# Altium schematic sheet 电动手推车原理图.SchDoc
size A3
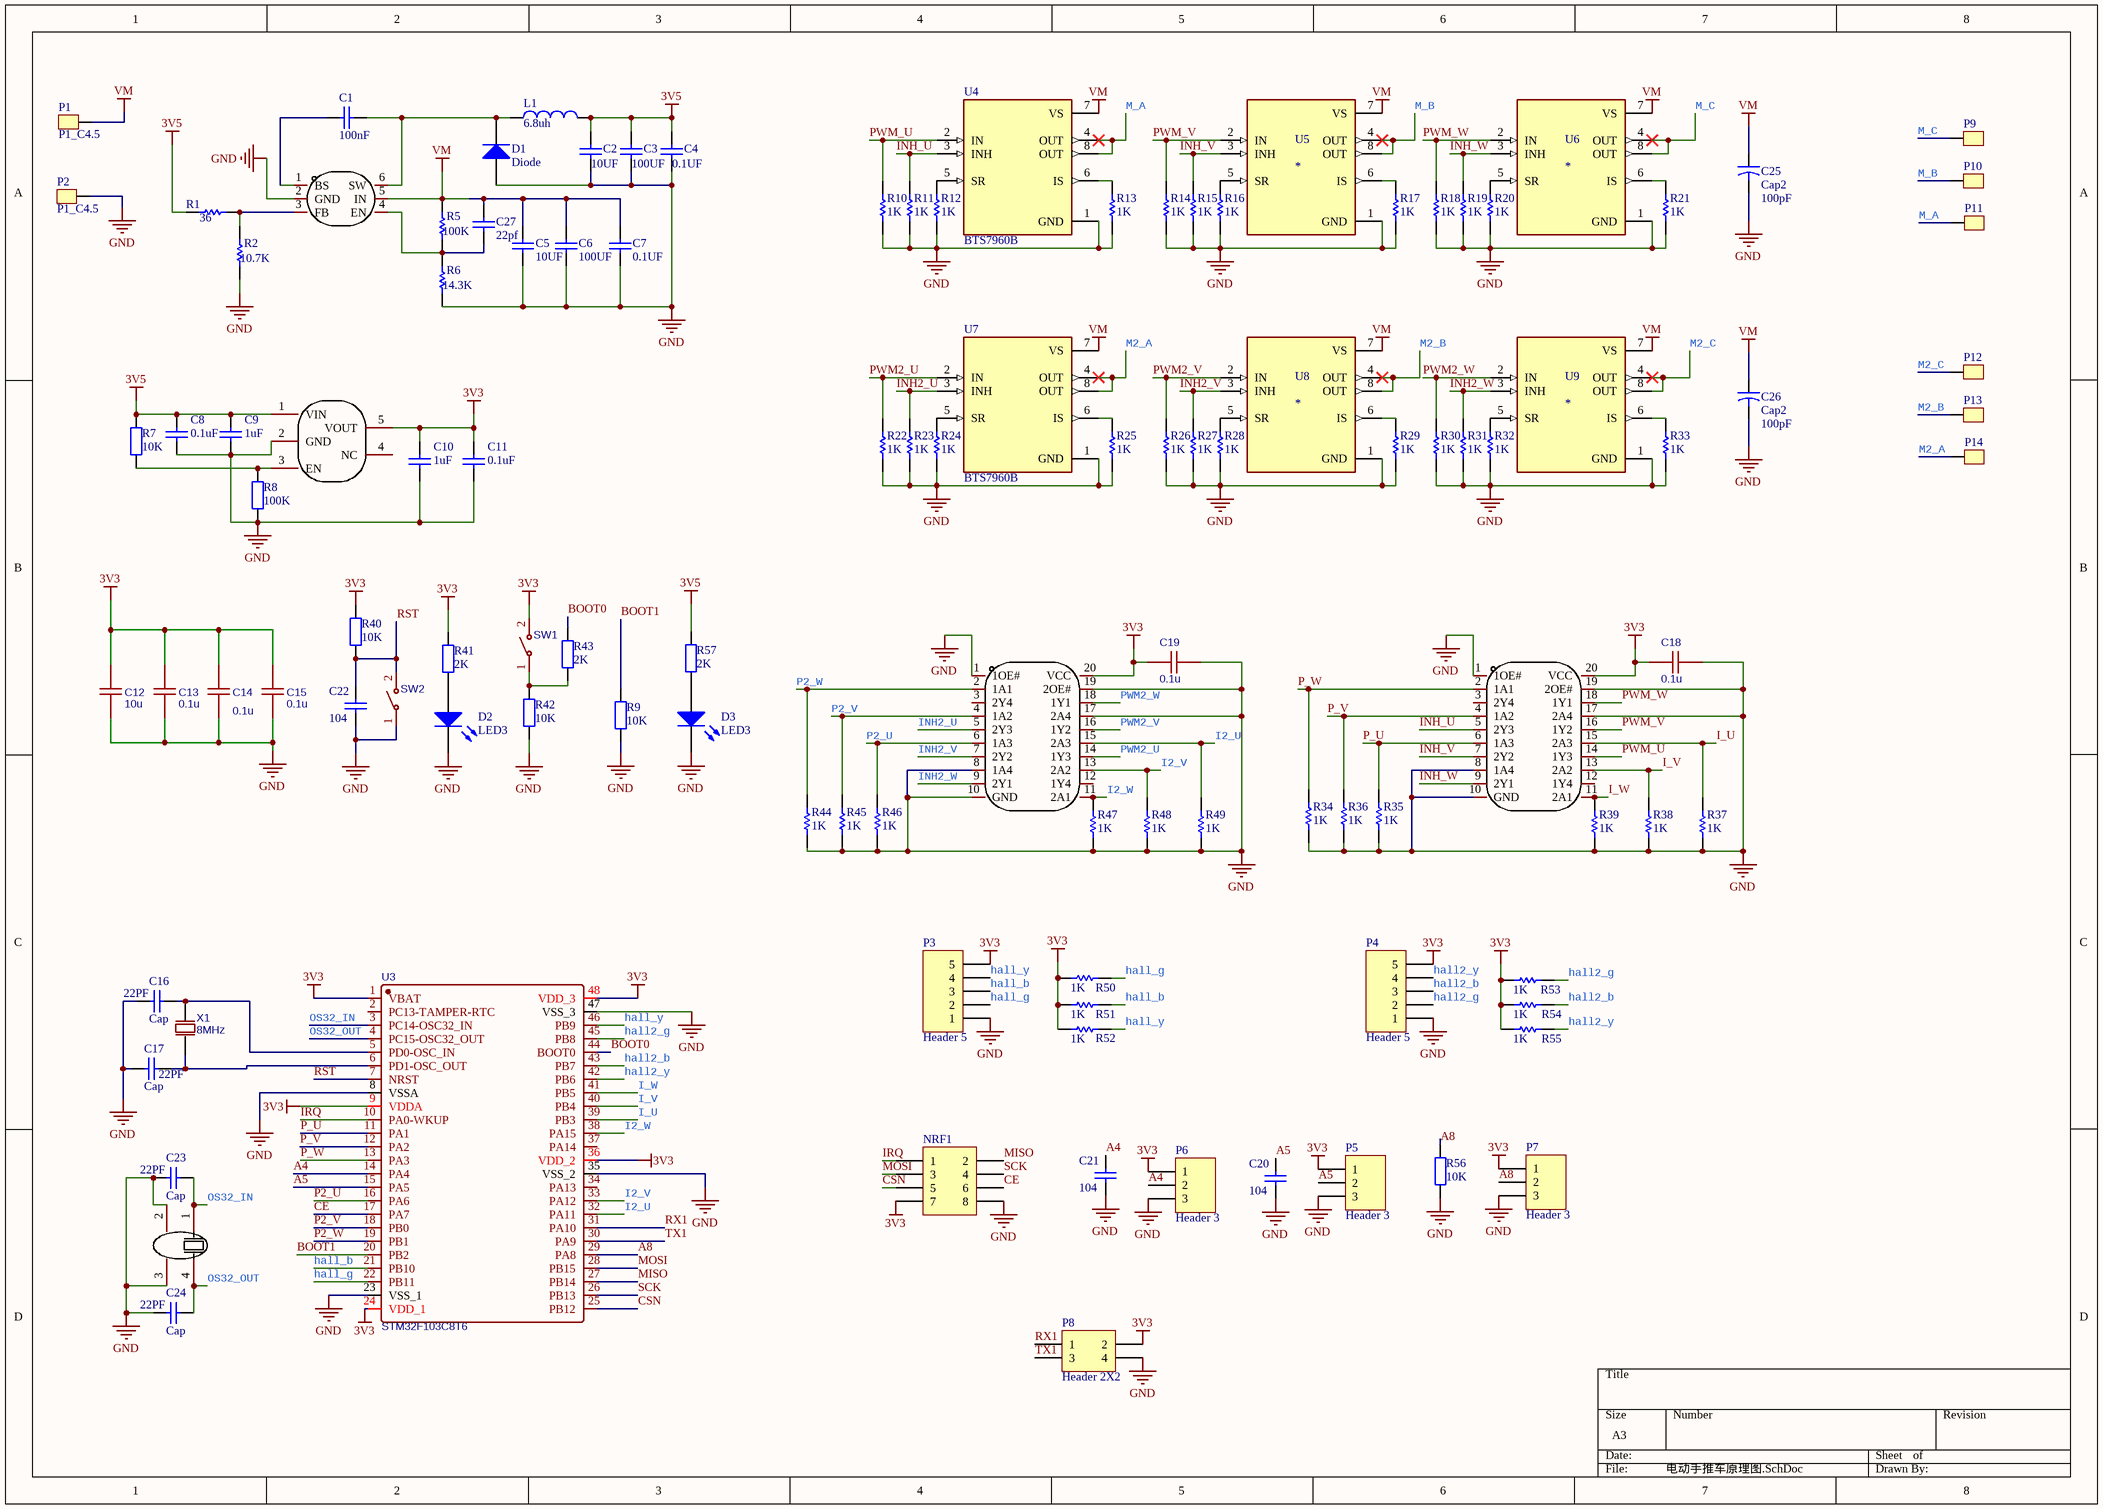
[diagram p0: 电动手推车原理图.SchDoc]

## Parts
C1  value 100nF  [C0805]
C2  value 10UF  [C0805]
C3  value 100UF  [C1210]
C4  value 0.1UF  [C0805]
C5  value 10UF  [C0805]
C6  value 100UF  [C1210]
C7  value 0.1UF  [C0805]
C8  value 0.1uF  [C1206]
C9  value 1uF  [C1206]
C10  value 1uF  [C1206]
C11  value 0.1uF  [C1206]
C12  10u  [C0805]
C13  0.1u  [C0805]
C14  0.1u  [C0805]
C15  0.1u  [C0805]
C16  Cap  value 22PF  [C0805]
C17  Cap  value 22PF  [C0805]
C18  0.1u  [C0805]
C19  0.1u  [C0805]
C20  value 104  [C0805]
C21  value 104  [C0805]
C22  value 104  [C0805]
C23  Cap  value 22PF  [C0805]
C24  Cap  value 22PF  [C0805]
C25  Cap2  value 100pF  [CAPR5-4X5]
C26  Cap2  value 100pF  [CAPR5-4X5]
C27  value 22pf  [C0805]
D1  Diode  [SMA]
D2  LED3  [LED0603-GREEN]
D3  LED3  [LED0603-GREEN]
L1  value 6.8uh  [0420-4.7μH]  (hidden comment: Inductor)
NRF1  Header 4X2  [HDR2X4]  (value not drawn)
P1  P1_C4.5  [P1_C4.5]
P2  P1_C4.5  [P1_C4.5]
P3  Header 5  [HDR1X5]
P4  Header 5  [HDR1X5]
P5  Header 3  [HDR1X3]
P6  Header 3  [HDR1X3]
P7  Header 3  [HDR1X3]
P8  Header 2X2  [HDR2X2]
P9  P1_C4.5  [P1_C4.5]  (value not drawn)
P10  P1_C4.5  [P1_C4.5]  (value not drawn)
P11  P1_C4.5  [P1_C4.5]  (value not drawn)
P12  P1_C4.5  [P1_C4.5]  (value not drawn)
P13  P1_C4.5  [P1_C4.5]  (value not drawn)
P14  P1_C4.5  [P1_C4.5]  (value not drawn)
R1  value 36  [R0603]
R2  value 10.7K  [R0603]
R5  value 100K  [R0603]
R6  value 14.3K  [R0603]
R7  value 10K  [R0603]
R8  value 100K  [R0603]
R9  value 10K  [R0603]
R10  value 1K  [R0603]
R11  value 1K  [R0603]
R12  value 1K  [R0603]
R13  value 1K  [R0603]
R14  value 1K  [R0603]
R15  value 1K  [R0603]
R16  value 1K  [R0603]
R17  value 1K  [R0603]
R18  value 1K  [R0603]
R19  value 1K  [R0603]
R20  value 1K  [R0603]
R21  value 1K  [R0603]
R22  value 1K  [R0603]
R23  value 1K  [R0603]
R24  value 1K  [R0603]
R25  value 1K  [R0603]
R26  value 1K  [R0603]
R27  value 1K  [R0603]
R28  value 1K  [R0603]
R29  value 1K  [R0603]
R30  value 1K  [R0603]
R31  value 1K  [R0603]
R32  value 1K  [R0603]
R33  value 1K  [R0603]
R34  value 1K  [R0603]
R35  value 1K  [R0603]
R36  value 1K  [R0603]
R37  value 1K  [R0603]
R38  value 1K  [R0603]
R39  value 1K  [R0603]
R40  value 10K  [R0603]
R41  value 2K  [R0603]
R42  value 10K  [R0603]
R43  value 2K  [R0603]
R44  value 1K  [R0603]
R45  value 1K  [R0603]
R46  value 1K  [R0603]
R47  value 1K  [R0603]
R48  value 1K  [R0603]
R49  value 1K  [R0603]
R50  value 1K  [R0603]
R51  value 1K  [R0603]
R52  value 1K  [R0603]
R53  value 1K  [R0603]
R54  value 1K  [R0603]
R55  value 1K  [R0603]
R56  value 10K  [R0603]
R57  value 2K  [R0603]
SW1  (no value)  [SW-SMD_L3.9-W3.0-P4.45]
SW2  (no value)  [SW-SMD_L3.9-W3.0-P4.45]
U1  TPMP2359DJ  [MP2359]  (value not drawn)
U2  RT9013-33GB  [SOP23-5_L3.0_W1.7_P0.95_LS2.8_BR]  (value not drawn)
U3  STM32F103C8T6  [STM32F103C8T6]
U4  BTS7960B  [PG-TO263-7-1]
U5  *  [PG-TO263-7-1]
U6  *  [PG-TO263-7-1]
U7  BTS7960B  [PG-TO263-7-1]
U8  *  [PG-TO263-7-1]
U9  *  [PG-TO263-7-1]
U10  SN74HC244DW  [SOIC-20_L13.0-W7.6-P1.27-LS10.3-BL]  (value not drawn)
U?  SN74HC244DW  [SOIC-20_L13.0-W7.6-P1.27-LS10.3-BL]  (value not drawn)
X1  8MHz  [HC-49S-SMD]
X2  FR08S4-32.768-N06LLDT  [OSC-SMD_4P-L8.0-W3.2-BL]  (value not drawn)

## Nets
3V3: C10.2 C11.2 C12.2 C13.2 C14.2 C15.2 C18.2 C19.2 NRF1.7 P3.5 P4.5 P5.1 P6.1 P7.1 P8.2 R40.2 R41.1 R50.1 R51.1 R52.1 R53.1 R54.1 R55.1 SW1.2 U2.5(VOUT) U3.1(VBAT) U3.9(VDDA) U3.24(VDD_1) U3.36(VDD_2) U3.48(VDD_3) U10.20(VCC) U?.20(VCC)
3V5: C2.1 C3.2 C4.2 C8.2 C9.2 L1.2 R1.2 R7.1 R57.1 U2.1(VIN)
GND: C2.2 C3.1 C4.1 C5.2 C6.1 C7.1 C8.1 C9.1 C10.1 C11.1 C12.1 C13.1 C14.1 C15.1 C16.1 C17.1 C18.1 C19.1 C20.1 C21.1 C22.1 C23.1 C24.1 C25.2 C26.2 D1.1(A) D2.2(K) D3.2(K) NRF1.8 P2.0 P3.1 P4.1 P5.3 P6.3 P7.3 P8.4 R2.1 R6.2 R8.1 R9.1 R10.2 R11.2 R12.1 R13.1 R14.1 R15.1 R16.1 R17.1 R18.1 R19.1 R20.1 R21.1 R22.2 R23.2 R24.1 R25.1 R26.1 R27.1 R28.1 R29.1 R30.1 R31.1 R32.1 R33.1 R34.2 R35.2 R36.2 R37.2 R38.1 R39.1 R42.1 R44.2 R45.2 R46.2 R47.1 R48.1 R49.2 R56.1 SW2.1 U1.2(GND) U2.2(GND) U3.8(VSSA) U3.23(VSS_1) U3.35(VSS_2) U3.47(VSS_3) U4.1(GND) U5.1(GND) U6.1(GND) U7.1(GND) U8.1(GND) U9.1(GND) U10.1(1OE#) U10.8(1A4) U10.10(GND) U10.17(2A4) U10.19(2OE#) U?.1(1OE#) U?.8(1A4) U?.10(GND) U?.17(2A4) U?.19(2OE#) X2.2 X2.3
VM: C5.1 C6.2 C7.2 C25.1 C26.1 C27.1 P1.0 R5.1 U1.5(IN) U4.7(VS) U5.7(VS) U6.7(VS) U7.7(VS) U8.7(VS) U9.7(VS)
A4: C21.2 P6.2 U3.14(PA4)
A5: C20.2 P5.2 U3.15(PA5)
A8: P7.2 R56.2 U3.29(PA8)
BOOT0: R43.1 U3.44(BOOT0)
BOOT1: R9.2 U3.20(PB2)
CE: NRF1.6 U3.17(PA7)
CSN: NRF1.5 U3.25(PB12)
hall2_b: P4.3 R54.2 U3.43(PB7)
hall2_g: P4.2 R53.2 U3.45(PB8)
hall2_y: P4.4 R55.2 U3.42(PB6)
hall_b: P3.3 R51.2 U3.21(PB10)
hall_g: P3.2 R50.2 U3.22(PB11)
hall_y: P3.4 R52.2 U3.46(PB9)
I2_U: R49.1 U3.32(PA11) U?.15(2A3)
I2_V: R48.2 U3.33(PA12) U?.13(2A2)
I2_W: R47.2 U3.38(PA15) U?.11(2A1)
I_U: R37.1 U3.39(PB3) U10.15(2A3)
I_V: R38.2 U3.40(PB4) U10.13(2A2)
I_W: R39.2 U3.41(PB5) U10.11(2A1)
INH2_U: R23.1 U7.3(INH) U?.5(2Y3)
INH2_V: R27.2 U8.3(INH) U?.7(2Y2)
INH2_W: R31.2 U9.3(INH) U?.9(2Y1)
INH_U: R11.1 U4.3(INH) U10.5(2Y3)
INH_V: R15.2 U5.3(INH) U10.7(2Y2)
INH_W: R19.2 U6.3(INH) U10.9(2Y1)
IRQ: NRF1.1 U3.10(PA0-WKUP)
M2_A: P14.0 U7.4(OUT) U7.8(OUT)
M2_B: P13.0 U8.4(OUT) U8.8(OUT)
M2_C: P12.0 U9.4(OUT) U9.8(OUT)
M_A: P11.0 U4.4(OUT) U4.8(OUT)
M_B: P10.0 U5.4(OUT) U5.8(OUT)
M_C: P9.0 U6.4(OUT) U6.8(OUT)
MISO: NRF1.2 U3.27(PB14)
MOSI: NRF1.3 U3.28(PB15)
OS32_IN: C23.2 U3.3(PC14-OSC32_IN) X2.1
OS32_OUT: C24.2 U3.4(PC15-OSC32_OUT) X2.4
P2_U: R46.1 U3.16(PA6) U?.6(1A3)
P2_V: R45.1 U3.18(PB0) U?.4(1A2)
P2_W: R44.1 U3.19(PB1) U?.2(1A1)
P_U: R35.1 U3.11(PA1) U10.6(1A3)
P_V: R36.1 U3.12(PA2) U10.4(1A2)
P_W: R34.1 U3.13(PA3) U10.2(1A1)
PWM2_U: R22.1 U7.2(IN) U?.14(1Y3)
PWM2_V: R26.2 U8.2(IN) U?.16(1Y2)
PWM2_W: R30.2 U9.2(IN) U?.18(1Y1)
PWM_U: R10.1 U4.2(IN) U10.14(1Y3)
PWM_V: R14.2 U5.2(IN) U10.16(1Y2)
PWM_W: R18.2 U6.2(IN) U10.18(1Y1)
RST: C22.2 R40.1 SW2.2 U3.7(NRST)
RX1: P8.1 U3.31(PA10)
SCK: NRF1.4 U3.26(PB13)
TX1: P8.3 U3.30(PA9)
NetC1_1: C1.1 D1.2(K) L1.1 U1.6(SW)
NetC1_2: C1.2 U1.1(BS)
NetC16_2: C16.2 U3.5(PD0-OSC_IN) X1.2(OSC2)
NetC17_2: C17.2 U3.6(PD1-OSC_OUT) X1.1(OSC1)
NetC27_2: C27.2 R5.2 R6.1 U1.4(EN)
NetD2_1: D2.1(A) R41.2
NetD3_1: D3.1(A) R57.2
NetR1_1: R1.1 R2.2 U1.3(FB)
NetR7_2: R7.2 R8.2 U2.3(EN)
NetR12_2: R12.2 U4.5(SR)
NetR13_2: R13.2 U4.6(IS)
NetR16_2: R16.2 U5.5(SR)
NetR17_2: R17.2 U5.6(IS)
NetR20_2: R20.2 U6.5(SR)
NetR21_2: R21.2 U6.6(IS)
NetR24_2: R24.2 U7.5(SR)
NetR25_2: R25.2 U7.6(IS)
NetR28_2: R28.2 U8.5(SR)
NetR29_2: R29.2 U8.6(IS)
NetR32_2: R32.2 U9.5(SR)
NetR33_2: R33.2 U9.6(IS)
NetR42_2: R42.2 R43.2 SW1.1

Not connected (* = marked no-connect by the designer): U2 4(NC); U3 2(PC13-TAMPER-RTC) 34(PA13) 37(PA14); U10 3(2Y4) 12(1Y4); U? 3(2Y4) 12(1Y4)

## Library data of the parts
C1-C11 C16 C17 C20-C24 C27 = Cap: Capacitor; Published: 8-Jun-2000; LatestRevisionDate: 17-Jul-2002; LatestRevisionNote: Re-released for DXP Platform.; PackageReference: RAD-0.3; Publisher: Altium Limited
C12 = 10u: nameAlias: Value(F); Contributor: LCEDA_Lib; spicePre: C; spiceSymbolName: C_0805_US
C13-C15 C18 C19 = 0.1u: nameAlias: Value(F); Contributor: LCEDA_Lib; spicePre: C; spiceSymbolName: C_0402_US
C25 C26 = Cap2: Capacitor; Published: 23-Sep-2002; PackageReference: CAPR5-4X5; Publisher: Altium Limited; PackageDescription: Capacitor; 2 Leads
D1 = Diode: Default Diode; Published: 8-Jun-2000; LatestRevisionDate: 17-Jul-2002; LatestRevisionNote: Re-released for DXP Platform.; PackageVersion: Sep-1996; PackageReference: SMC; Publisher: Altium Limited; PackageDescription: DO-214-AB/SMC; 2 C-Bend Leads; Body 7.9 x 5.9 mm, inc. leads (LxW); Code_JEDEC: DO-214-AB
D2 D3 = LED3: Typical BLUE SiC LED; Published: 8-Jun-2000; LatestRevisionDate: 17-Dec-2003; LatestRevisionNote: PCB Footprint replaced.; DatasheetVersion: 16-Apr-2002; PackageVersion: 16-Apr-2002; PackageReference: 3.5X2.8X1.9; Publisher: Altium Limited; PackageDescription: SM LED; 2 C-Bend Leads; Body 3.5 x 2.8 x 1.9 mm, inc leads (LxWxH typ)
L1 = Inductor: Code_IEC: 1005; Published: 8-Jun-2000; LatestRevisionDate: 29-May-2009; LatestRevisionNote: IPC-7351 Footprint Added.; PackageReference: 0402-A; Publisher: Altium Limited; PackageDescription: Chip Inductor; Code_JEITA: 0402
NRF1 = Header 4X2: Header, 4-Pin, Dual row; LatestRevisionDate: 17-Jul-2002; LatestRevisionNote: Re-released for DXP Platform.; Publisher: Altium Limited
P3 P4 = Header 5: Header, 5-Pin; LatestRevisionDate: 17-Jul-2002; LatestRevisionNote: Re-released for DXP Platform.; Publisher: Altium Limited
P5-P7 = Header 3: Header, 3-Pin; LatestRevisionDate: 17-Jul-2002; LatestRevisionNote: Re-released for DXP Platform.; Publisher: Altium Limited
P8 = Header 2X2: Header, 2-Pin, Dual row; LatestRevisionDate: 17-Jul-2002; LatestRevisionNote: Re-released for DXP Platform.; Publisher: Altium Limited
R1 R2 R5 R6 R10-R39 R44-R55 = Res1: Resistor; Published: 8-Jun-2000; LatestRevisionDate: 17-Jul-2002; LatestRevisionNote: Re-released for DXP Platform.; PackageReference: AXIAL-0.3; Publisher: Altium Limited
R7-R9 R40-R43 R56 R57 = Res2: Resistor; Published: 8-Jun-2000; LatestRevisionDate: 17-Jul-2002; LatestRevisionNote: Re-released for DXP Platform.; PackageReference: AXIAL-0.4; Publisher: Altium Limited
SW1 SW2 = TAEF-25R-V-T/R: BOM_Manufacturer: Diptronics; Contributor: LCSC; BOM_Supplier: LCSC; BOM_Supplier Part: C495936; BOM_Manufacturer Part: TAEF-25R-V-T/R; spicePre: S; spiceSymbolName: TAEF-25R-V-T/R
U1 = TPMP2359DJ: Manufacturer: TECH PUBLIC(台舟); Add into BOM: yes; Name: TPMP2359DJ; Symbol: TPMP2359DJ; Device: TPMP2359DJ; LCSC Part Name: TPMP2359DJ; Supplier Part: C2959845; Manufacturer Part: TPMP2359DJ; Supplier Footprint: SOT23-6; JLCPCB Part Class: Extended Part; Datasheet: https://atta.szlcsc.com/upload/public/pdf/source/20220124/136D7E5097025173C84A8EB547201C3F.pdf; Supplier: LCSC; Convert to PCB: yes
U2 = RT9013-33GB: Manufacturer: RICHTEK(立锜); Add into BOM: yes; Output Type: 固定; Output Polarity: 正; Number of Outputs: 1; Maximum Input Voltage: 5.5V; Output Voltage: 3.3V; Dropout Voltage: 400mV@(500mA); Output Current: 500mA; Power Supply Rejection Ratio (PSRR): 50dB@(10kHz); Name: RT9013-33GB; Symbol: RT9013-33GB; Device: RT9013-33GB; LCSC Part Name: 正 Vin=5.5V Vout=3.3V 500mA 50dB@(10kHz); Supplier Part: C47773; Manufacturer Part: RT9013-33GB; Supplier Footprint: SOT-23-5; JLCPCB Part Class: Extended Part; Datasheet: https://atta.szlcsc.com/upload/public/pdf/source/20150504/1457707282459.pdf; Supplier: LCSC; Convert to PCB: yes; Quiescent Current (Ground Current): -; Noise: -; Feature: -
U3 = STM32F103C8T6: BOM_Manufacturer: STMicroelectronics; SMT Type: Basic; timeStamp: 1455028086; BOM_Supplier: LCSC; BOM_Manufacturer Part: STM32F103C8T6; image: //image.lceda.cn/szlcsc/C8734.jpg; BOM_Supplier Part: C8734; BOM_JLCPCB SMD: Yes; spicePre: U; spiceSymbolName: STM32F103C8T6
U4-U9 = BTS7960B: Half Bridge Driver DC Motors, General Purpose DMOS PG-TO263-7-1; MF: Infineon; Package: TO-263 Infineon; Check_prices: https://www.snapeda.com/parts/BTS7960B/Infineon+Technologies/view-part/?ref=eda; Availability: In Stock; MP: BTS7960B; Value: *; Price: None; SnapEDA_Link: https://www.snapeda.com/parts/BTS7960B/Infineon+Technologies/view-part/?ref=snap
U10 U? = SN74HC244DW: Manufacturer: TI(德州仪器); Add into BOM: yes; Supply Voltage: 2V~6V; output type: 三态; Current-OutputLow: 7.8mA; Name: SN74HC244DW; Symbol: SN74HC244DW; Device: SN74HC244DW; LCSC Part Name: SN74HC244DW; Supplier Part: C1548087; Manufacturer Part: SN74HC244DW; Supplier Footprint: SOIC-20; JLCPCB Part Class: Extended Part; Supplier: LCSC; Convert to PCB: yes; Type: 缓冲器，非反相; Input type: -; Current-OutputHigh: 7.8mA; Operating temperature: -40℃~+85℃
X1 = 8MHz: BOM_Manufacturer: ZheJiang East Crystal Elec; BOM_Manufacturer Part: C08000J060; nameAlias: Frequency; Contributor: LCSC; BOM_Supplier: LCSC; BOM_Supplier Part: C259040; spicePre: X; spiceSymbolName: C08000J060
X2 = FR08S4-32.768-N06LLDT: Manufacturer: HCI(杭晶); Name: 32.768kHz; Add into BOM: yes; Crystal Type: 贴片无源晶振; Value: 32.768kHz; Frequency Tolerance: ±20ppm; Load Capacitance: 6pF; Equivalent Series Resistance (ESR): 50kΩ; Symbol: FR08S4-32.768-N06LLDT; Device: FR08S4-32.768-N06LLDT; LCSC Part Name: 32.768kHz ±20ppm 6pF; Supplier Part: C2842183; Manufacturer Part: FR08S4-32.768-N06LLDT; Supplier Footprint: MC-306; JLCPCB Part Class: Extended Part; Datasheet: https://atta.szlcsc.com/upload/public/pdf/source/20220525/0AFFB71AD450334CFFCC391A2D0E6102.pdf; Supplier: LCSC; Convert to PCB: yes; Frequency Stability: ±20ppm; Operating Temperature: -40℃~+85℃